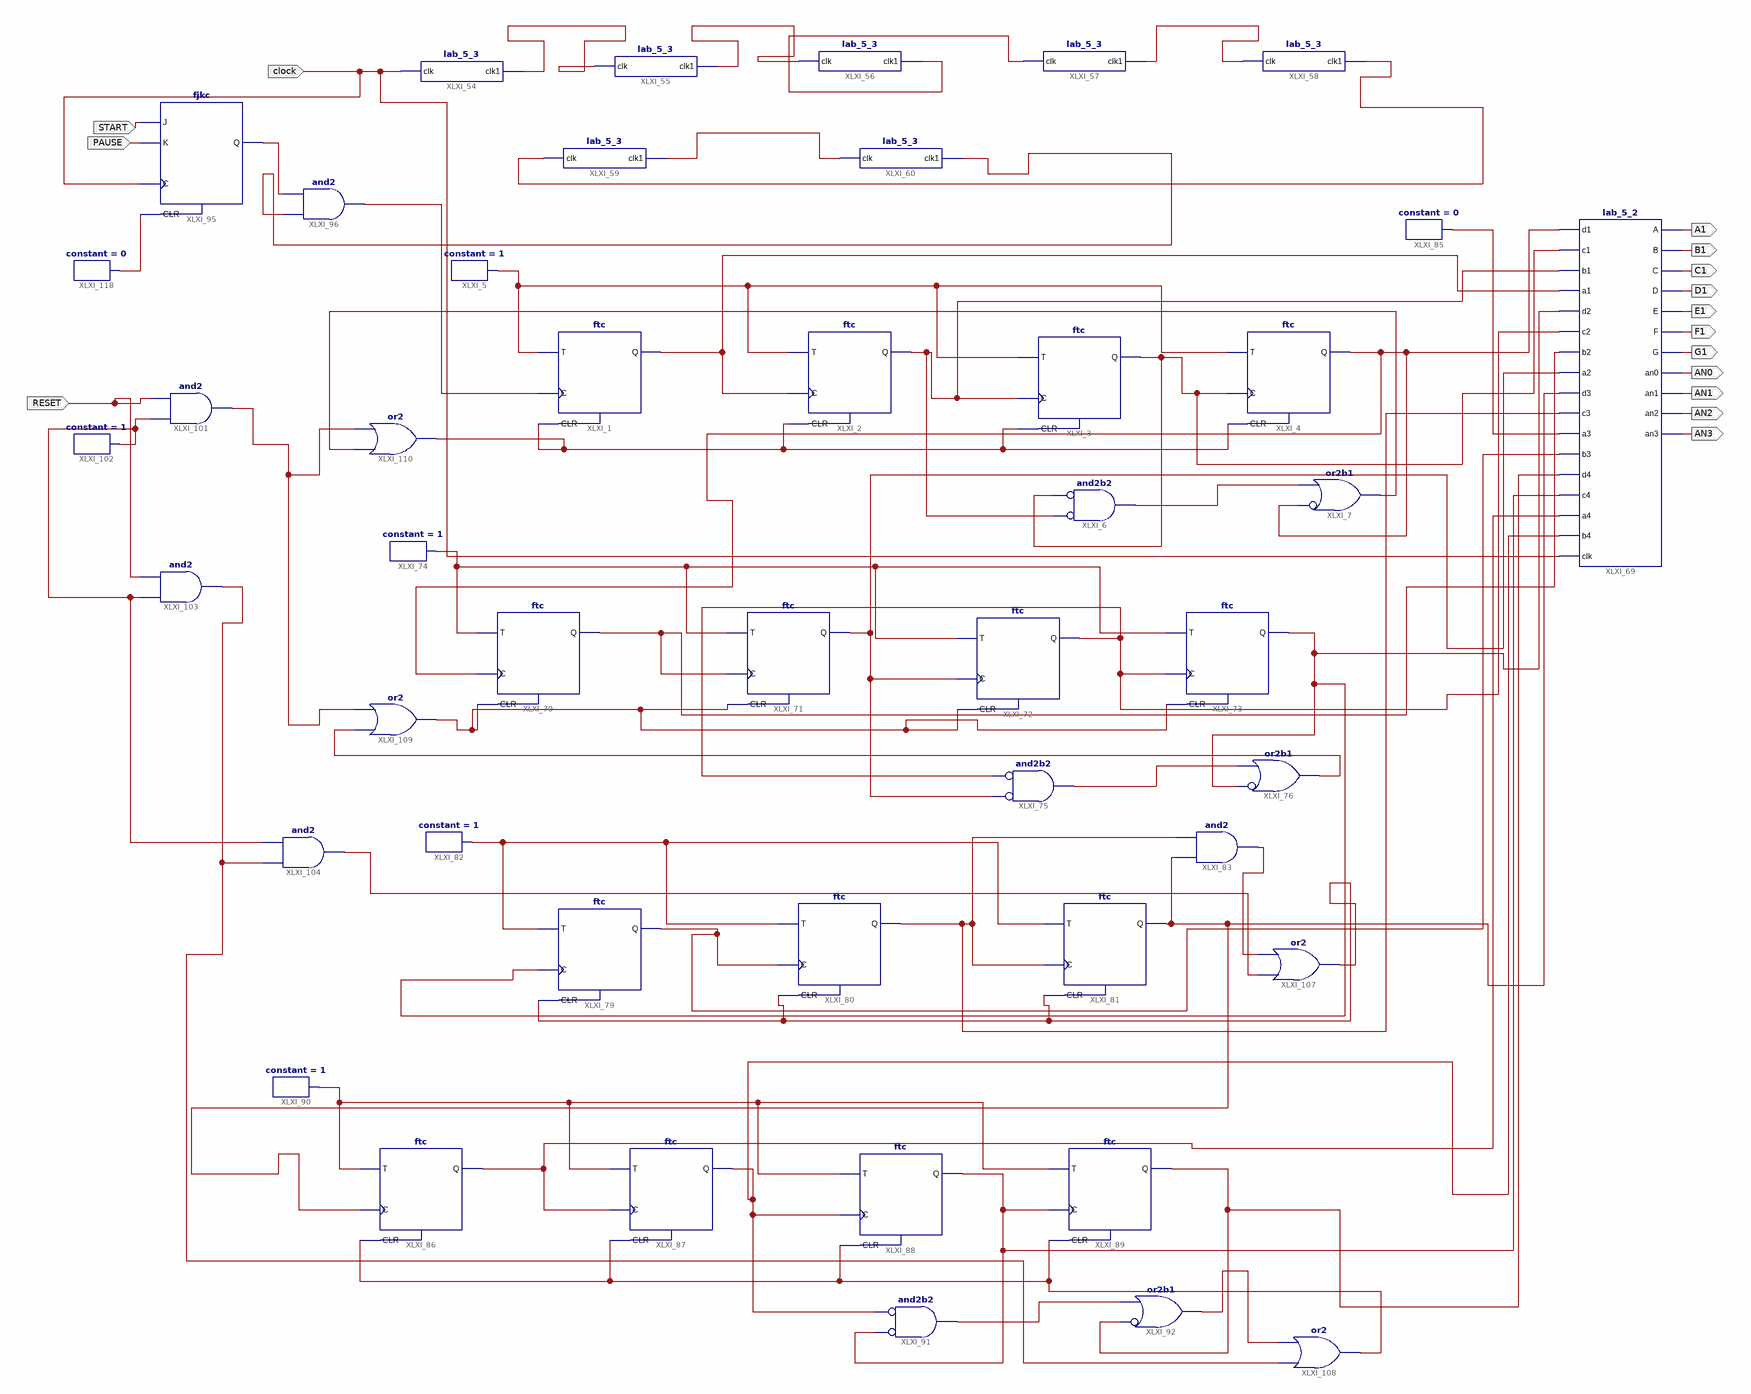
[diagram p0: schematic sheet 1]
// Xilinx ISE schematic lab_5_1.sch (spartan6) as structural Verilog: 46 symbols, 15 ports
module lab_5_1 (
  input  clock,
  input  START,
  input  PAUSE,
  input  RESET,
  output A1,
  output B1,
  output C1,
  output D1,
  output E1,
  output F1,
  output G1,
  output AN0,
  output AN1,
  output AN2,
  output AN3
);

  wire XLXN_4, XLXN_7, XLXN_174, XLXN_175, XLXN_176, XLXN_193, XLXN_195, XLXN_202, XLXN_207, XLXN_208,
       XLXN_210, XLXN_218, XLXN_219, XLXN_220, XLXN_234, XLXN_235, XLXN_236, XLXN_239, XLXN_240, XLXN_242,
       XLXN_245, XLXN_246, XLXN_279, XLXN_281, XLXN_284, XLXN_289, XLXN_293, XLXN_294, XLXN_298, XLXN_303,
       XLXN_307, XLXN_310, XLXN_312, XLXN_314, XLXN_316, XLXN_317, XLXN_318, XLXN_319, XLXN_321, XLXN_323,
       XLXN_324, XLXN_327, XLXN_329, XLXN_332, XLXN_333;

  lab_5_3 XLXI_54 (.clk(clock), .clk1(XLXN_317));
  lab_5_3 XLXI_55 (.clk(XLXN_317), .clk1(XLXN_318));
  lab_5_3 XLXI_56 (.clk(XLXN_318), .clk1(XLXN_319));
  lab_5_3 XLXI_57 (.clk(XLXN_319), .clk1(XLXN_321));
  lab_5_3 XLXI_58 (.clk(XLXN_321), .clk1(XLXN_323));
  lab_5_3 XLXI_59 (.clk(XLXN_323), .clk1(XLXN_324));
  lab_5_3 XLXI_60 (.clk(XLXN_324), .clk1(XLXN_316));
  ftc XLXI_1 (.C(XLXN_245), .CLR(XLXN_312), .T(XLXN_4), .Q(XLXN_195));
  ftc XLXI_2 (.C(XLXN_195), .CLR(XLXN_312), .T(XLXN_4), .Q(XLXN_329));
  ftc XLXI_3 (.C(XLXN_329), .CLR(XLXN_312), .T(XLXN_4), .Q(XLXN_327));
  ftc XLXI_4 (.C(XLXN_327), .CLR(XLXN_312), .T(XLXN_4), .Q(XLXN_176));
  constant #(.CValue("1")) XLXI_5 (.O(XLXN_4));
  and XLXI_6 (XLXN_7, ~XLXN_329, ~XLXN_327);  // and2b2
  or XLXI_7 (XLXN_314, ~XLXN_176, XLXN_7);  // or2b1
  lab_5_2 XLXI_69 (
    .d1(XLXN_176), .c1(XLXN_327), .b1(XLXN_329), .a1(XLXN_195), .d2(XLXN_210), .c2(XLXN_193), .b2(XLXN_207),
    .a2(XLXN_208), .d3(XLXN_242), .c3(XLXN_332), .a3(XLXN_218), .b3(XLXN_240), .d4(XLXN_239), .c4(XLXN_236),
    .a4(XLXN_234), .b4(XLXN_235), .clk(clock), .A(A1), .B(B1), .C(C1), .D(D1), .E(E1), .F(F1), .G(G1),
    .an0(AN0), .an1(AN1), .an2(AN2), .an3(AN3));
  ftc XLXI_70 (.C(XLXN_176), .CLR(XLXN_307), .T(XLXN_174), .Q(XLXN_207));
  ftc XLXI_71 (.C(XLXN_207), .CLR(XLXN_307), .T(XLXN_174), .Q(XLXN_208));
  ftc XLXI_72 (.C(XLXN_208), .CLR(XLXN_307), .T(XLXN_174), .Q(XLXN_193));
  ftc XLXI_73 (.C(XLXN_193), .CLR(XLXN_307), .T(XLXN_174), .Q(XLXN_210));
  constant #(.CValue("1")) XLXI_74 (.O(XLXN_174));
  and XLXI_75 (XLXN_175, ~XLXN_208, ~XLXN_193);  // and2b2
  or XLXI_76 (XLXN_310, ~XLXN_210, XLXN_175);  // or2b1
  ftc XLXI_79 (.C(XLXN_210), .CLR(XLXN_293), .T(XLXN_202), .Q(XLXN_240));
  ftc XLXI_80 (.C(XLXN_240), .CLR(XLXN_293), .T(XLXN_202), .Q(XLXN_332));
  ftc XLXI_81 (.C(XLXN_332), .CLR(XLXN_293), .T(XLXN_202), .Q(XLXN_242));
  constant #(.CValue("1")) XLXI_82 (.O(XLXN_202));
  and XLXI_83 (XLXN_289, XLXN_242, XLXN_332);
  constant #(.CValue("0")) XLXI_85 (.O(XLXN_218));
  ftc XLXI_86 (.C(XLXN_242), .CLR(XLXN_298), .T(XLXN_219), .Q(XLXN_234));
  ftc XLXI_87 (.C(XLXN_234), .CLR(XLXN_298), .T(XLXN_219), .Q(XLXN_235));
  ftc XLXI_88 (.C(XLXN_235), .CLR(XLXN_298), .T(XLXN_219), .Q(XLXN_236));
  ftc XLXI_89 (.C(XLXN_236), .CLR(XLXN_298), .T(XLXN_219), .Q(XLXN_239));
  constant #(.CValue("1")) XLXI_90 (.O(XLXN_219));
  and XLXI_91 (XLXN_220, ~XLXN_236, ~XLXN_235);  // and2b2
  or XLXI_92 (XLXN_294, ~XLXN_239, XLXN_220);  // or2b1
  fjkc XLXI_95 (.C(clock), .CLR(XLXN_333), .J(START), .K(PAUSE), .Q(XLXN_246));
  and XLXI_96 (XLXN_245, XLXN_316, XLXN_246);
  and XLXI_101 (XLXN_279, XLXN_284, RESET);
  constant #(.CValue("1")) XLXI_102 (.O(XLXN_284));
  and XLXI_103 (XLXN_281, XLXN_284, RESET);
  and XLXI_104 (XLXN_303, XLXN_281, XLXN_284);
  or XLXI_107 (XLXN_293, XLXN_303, XLXN_289);
  or XLXI_108 (XLXN_298, XLXN_281, XLXN_294);
  or XLXI_109 (XLXN_307, XLXN_310, XLXN_279);
  or XLXI_110 (XLXN_312, XLXN_314, XLXN_279);
  constant #(.CValue("0")) XLXI_118 (.O(XLXN_333));
endmodule
